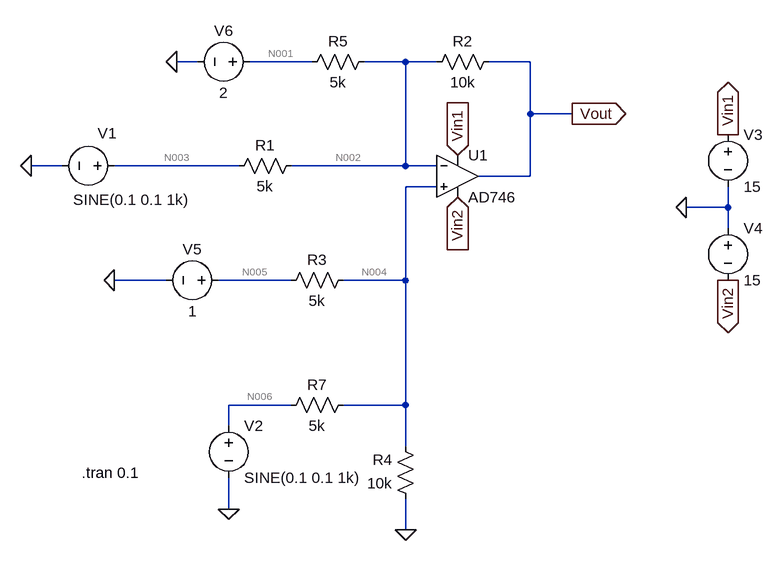
[diagram p0: schematic lab1_2.asc]
lab1_2.asc, the LTspice schematic file:
Version 4
SHEET 1 984 680
WIRE -32 -64 -64 -64
WIRE 144 -64 48 -64
WIRE 288 -64 224 -64
WIRE 336 -64 288 -64
WIRE 480 -64 416 -64
WIRE 480 16 480 -64
WIRE 544 16 480 16
WIRE -240 96 -288 96
WIRE 32 96 -160 96
WIRE 288 96 288 -64
WIRE 288 96 112 96
WIRE 336 96 288 96
WIRE 480 112 480 16
WIRE 480 112 400 112
WIRE 336 128 288 128
WIRE 784 160 784 128
WIRE 784 160 720 160
WIRE 784 192 784 160
WIRE -80 272 -160 272
WIRE 112 272 0 272
WIRE 288 272 288 128
WIRE 288 272 192 272
WIRE 112 464 16 464
WIRE 288 464 288 272
WIRE 288 464 192 464
WIRE 16 496 16 464
WIRE 288 528 288 464
WIRE 16 624 16 576
WIRE 288 656 288 608
FLAG 288 656 0
FLAG 16 624 0
FLAG -288 96 0
FLAG 544 16 Vout
IOPIN 544 16 Out
FLAG 784 48 Vin1
IOPIN 784 48 Out
FLAG 720 160 0
FLAG 784 272 Vin2
IOPIN 784 272 Out
FLAG 368 80 Vin1
IOPIN 368 80 In
FLAG 368 144 Vin2
IOPIN 368 144 In
FLAG -160 272 0
FLAG -64 -64 0
SYMBOL res 128 80 R90
WINDOW 0 0 56 VBottom 2
WINDOW 3 32 56 VTop 2
SYMATTR InstName R1
SYMATTR Value 5k
SYMBOL res 432 -80 R90
WINDOW 0 0 56 VBottom 2
WINDOW 3 32 56 VTop 2
SYMATTR InstName R2
SYMATTR Value 10k
SYMBOL res 208 448 R90
WINDOW 0 0 56 VBottom 2
WINDOW 3 32 56 VTop 2
SYMATTR InstName R7
SYMATTR Value 5k
SYMBOL res 304 624 R180
WINDOW 0 36 76 Left 2
WINDOW 3 36 40 Left 2
SYMATTR InstName R4
SYMATTR Value 10k
SYMBOL voltage -144 96 R90
WINDOW 0 -50 12 VRight 2
WINDOW 3 52 -99 VRight 2
WINDOW 123 0 0 Left 0
WINDOW 39 0 0 Left 0
SYMATTR InstName V1
SYMATTR Value SINE(0.1 0.1 1k)
SYMBOL voltage 16 480 R0
WINDOW 123 0 0 Left 0
WINDOW 39 0 0 Left 0
SYMATTR InstName V2
SYMATTR Value SINE(0.1 0.1 1k)
SYMBOL Opamps\\AD746 368 48 R0
SYMATTR InstName U1
SYMBOL voltage 784 32 R0
WINDOW 123 0 0 Left 0
WINDOW 39 0 0 Left 0
SYMATTR InstName V3
SYMATTR Value 15
SYMBOL voltage 784 176 R0
WINDOW 123 0 0 Left 0
WINDOW 39 0 0 Left 0
SYMATTR InstName V4
SYMATTR Value 15
SYMBOL voltage 64 -64 R90
WINDOW 0 -32 56 VBottom 2
WINDOW 3 32 56 VTop 2
WINDOW 123 0 0 Left 0
WINDOW 39 0 0 Left 0
SYMATTR InstName V6
SYMATTR Value 2
SYMBOL voltage 16 272 R90
WINDOW 0 -32 56 VBottom 2
WINDOW 3 32 56 VTop 2
WINDOW 123 0 0 Left 0
WINDOW 39 0 0 Left 0
SYMATTR InstName V5
SYMATTR Value 1
SYMBOL res 208 256 R90
WINDOW 0 0 56 VBottom 2
WINDOW 3 32 56 VTop 2
SYMATTR InstName R3
SYMATTR Value 5k
SYMBOL res 240 -80 R90
WINDOW 0 0 56 VBottom 2
WINDOW 3 32 56 VTop 2
SYMATTR InstName R5
SYMATTR Value 5k
TEXT -210 568 Left 2 !.tran 0.1

The netlist it stands for:
* lab1_2.asc
R1 N002 N003 5k
R2 Vout N002 10k
R7 N004 N006 5k
R4 0 N004 10k
V1 N003 0 SINE(0.1 0.1 1k)
V2 N006 0 SINE(0.1 0.1 1k)
XU1 N004 N002 Vin1 Vin2 Vout AD746  ; pins In+ In- V+ V- OUT
V3 Vin1 0 15
V4 0 Vin2 15
V6 N001 0 2
V5 N005 0 1
R3 N004 N005 5k
R5 N002 N001 5k
.tran 0.1
.backanno
.end

* Results of the author's LTspice run, read from the files saved beside the schematic
* Operating Point, zero values left out:
*   V(n002) = 440 mV
*   V(n003) = 100 mV
*   V(vout) = -2 V
*   V(n004) = 440 mV
*   V(n006) = 100 mV
*   V(vin1) = 15 V
*   V(vin2) = -15 V
*   V(n001) = 2 V
*   V(n005) = 1 V
*   I(R5) = -312 µA
*   I(R3) = -112 µA
*   I(R4) = -44 µA
*   I(R7) = 68 µA
*   I(R2) = -244 µA
*   I(R1) = 68 µA
*   I(V5) = -112 µA
*   I(V6) = -312 µA
*   I(V4) = -5.044 mA
*   I(V3) = -4.8 mA
*   I(V2) = 68 µA
*   I(V1) = 68 µA
*   Ix(u1:1) = 124.1 pA
*   Ix(u1:2) = 124.1 pA
*   Ix(u1:3) = 4.8 mA
*   Ix(u1:4) = -5.044 mA
*   Ix(u1:5) = 244 µA
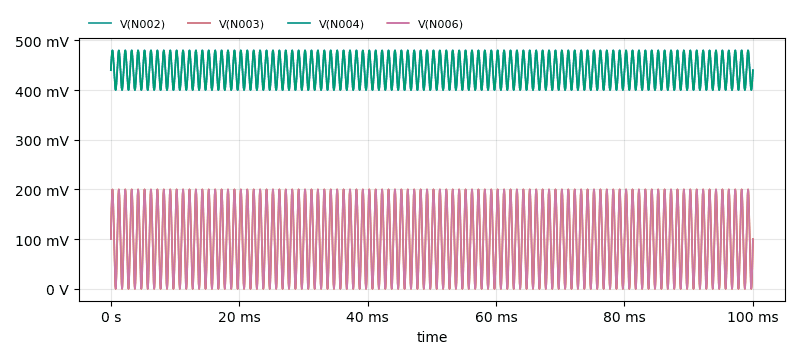
[diagram p1: Transient Analysis of lab1_2.asc, plotted from the saved traces]
* Transient Analysis, 1 run:
*   V(N002): min 400.1 mV, max 479.9 mV, average 440 mV, rms 440.9 mV, last 440 mV
*   V(N003): min 697.8 nV, max 200 mV, average 100 mV, rms 123.1 mV, last 100 mV
*   V(N004): min 400.1 mV, max 479.9 mV, average 440 mV, rms 440.9 mV, last 440 mV
*   V(N006): min 697.8 nV, max 200 mV, average 100 mV, rms 123.1 mV, last 100 mV